# Altium schematic sheet Connectors.SchDoc
size A4
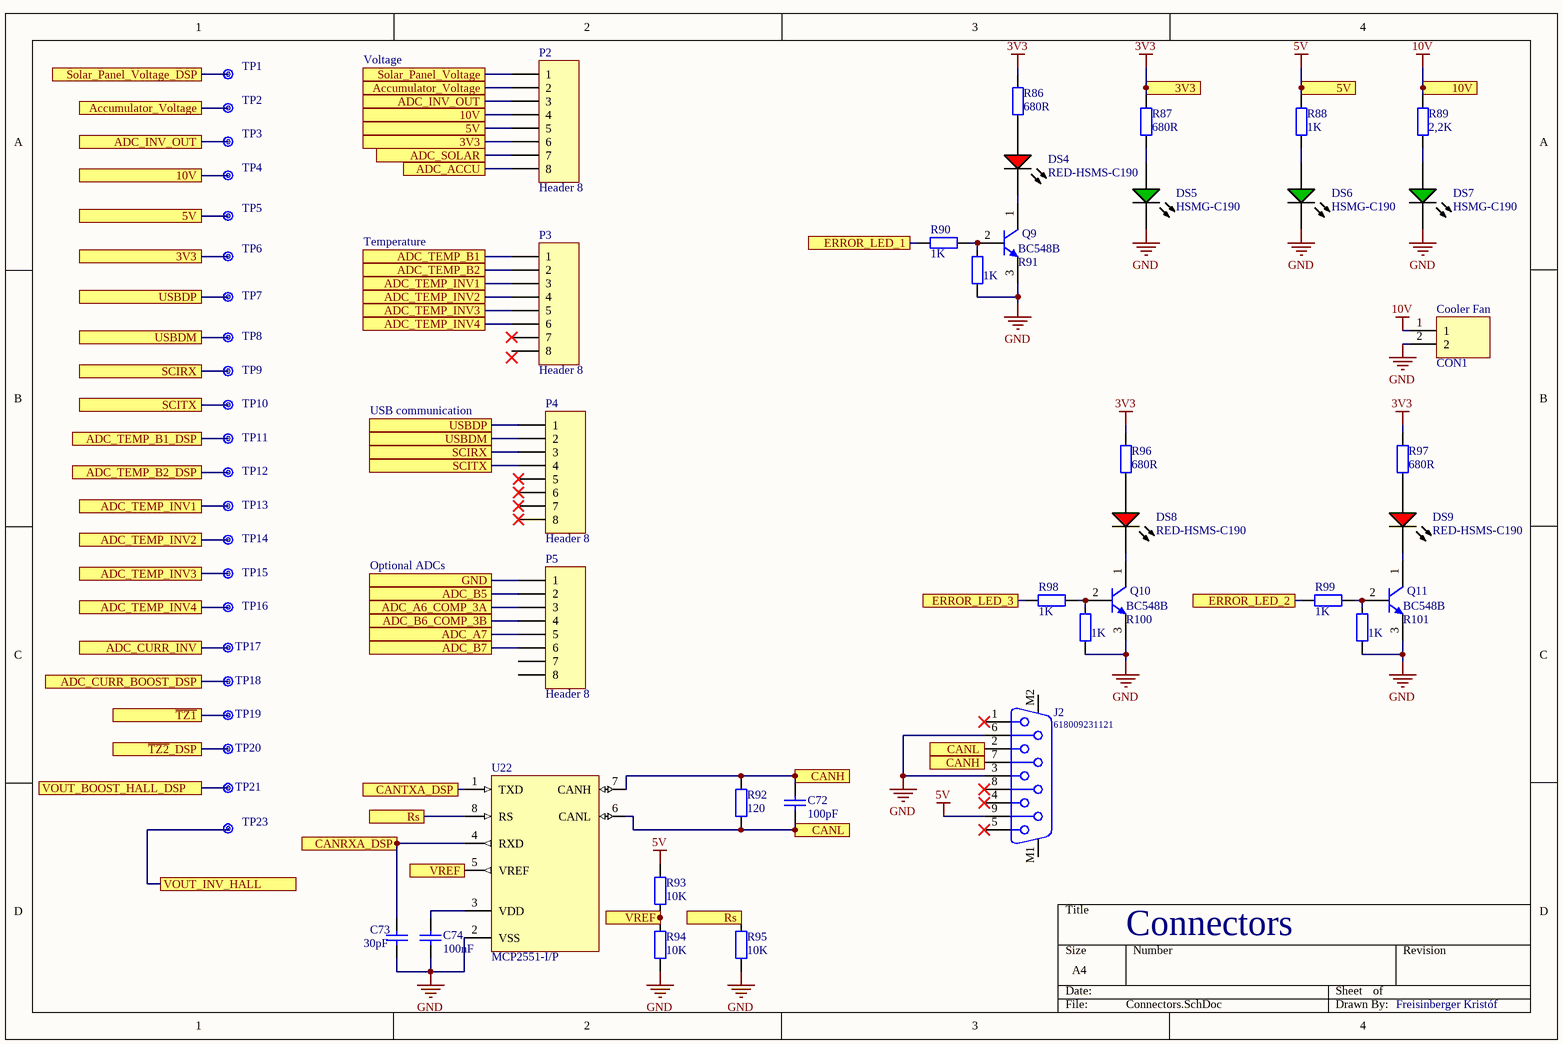
[diagram p0: Connectors.SchDoc]

## Parts
C72  100pF  [FP_0805_CAP_085]
C73  30pF  [FP_0805_CAP_085]
C74  100nF  [FP_0805_CAP_085]
CON1  Connector  [FP_CONN2_TAP_254MM_90]  (value not drawn)
DS4  RED-HSMS-C190  [AVAG-HSMX-C190_V]
DS5  HSMG-C190  [AVAG-HSMX-C190_V]
DS6  HSMG-C190  [AVAG-HSMX-C190_V]
DS7  HSMG-C190  [AVAG-HSMX-C190_V]
DS8  RED-HSMS-C190  [AVAG-HSMX-C190_V]
DS9  RED-HSMS-C190  [AVAG-HSMX-C190_V]
J2  618009231121  [618009231121]
P2  Header 8  [HDR1X8]
P3  Header 8  [HDR1X8]
P4  Header 8  [HDR1X8]
P5  Header 8  [HDR1X8]
Q9  BC548B  [ONSC-TO-92-3-29-11_AM_BL]
Q10  BC548B  [ONSC-TO-92-3-29-11_AM_BL]
Q11  BC548B  [ONSC-TO-92-3-29-11_AM_BL]
R86  680R  [FP_0805_RES]
R87  680R  [FP_0805_RES]
R88  1K  [FP_0805_RES]
R89  2,2K  [FP_0805_RES]
R90  1K  [FP_0805_RES]
R91  1K  [FP_0805_RES]
R92  120  [FP_0805_RES]
R93  10K  [FP_0805_RES]
R94  10K  [FP_0805_RES]
R95  10K  [FP_0805_RES]
R96  680R  [FP_0805_RES]
R97  680R  [FP_0805_RES]
R98  1K  [FP_0805_RES]
R99  1K  [FP_0805_RES]
R100  1K  [FP_0805_RES]
R101  1K  [FP_0805_RES]
TP1  TestPoint  [Test_Point]  (value not drawn)  (no BOM)
TP2  TestPoint  [Test_Point]  (value not drawn)  (no BOM)
TP3  TestPoint  [Test_Point]  (value not drawn)  (no BOM)
TP4  TestPoint  [Test_Point]  (value not drawn)  (no BOM)
TP5  TestPoint  [Test_Point]  (value not drawn)  (no BOM)
TP6  TestPoint  [Test_Point]  (value not drawn)  (no BOM)
TP7  TestPoint  [Test_Point]  (value not drawn)  (no BOM)
TP8  TestPoint  [Test_Point]  (value not drawn)  (no BOM)
TP9  TestPoint  [Test_Point]  (value not drawn)  (no BOM)
TP10  TestPoint  [Test_Point]  (value not drawn)  (no BOM)
TP11  TestPoint  [Test_Point]  (value not drawn)  (no BOM)
TP12  TestPoint  [Test_Point]  (value not drawn)  (no BOM)
TP13  TestPoint  [Test_Point]  (value not drawn)  (no BOM)
TP14  TestPoint  [Test_Point]  (value not drawn)  (no BOM)
TP15  TestPoint  [Test_Point]  (value not drawn)  (no BOM)
TP16  TestPoint  [Test_Point]  (value not drawn)  (no BOM)
TP17  TestPoint  [Test_Point]  (value not drawn)  (no BOM)
TP18  TestPoint  [Test_Point]  (value not drawn)  (no BOM)
TP19  TestPoint  [Test_Point]  (value not drawn)  (no BOM)
TP20  TestPoint  [Test_Point]  (value not drawn)  (no BOM)
TP21  TestPoint  [Test_Point]  (value not drawn)  (no BOM)
TP23  TestPoint  [Test_Point]  (value not drawn)  (no BOM)
U22  MCP2551-I/P  [PDIP300-P8]

## Ports
3V3, 5V, 10V, Accumulator_Voltage, ADC_A6_COMP_3A, ADC_A7, ADC_ACCU, ADC_B5, ADC_B6_COMP_3B, ADC_B7, ADC_CURR_BOOST_DSP, ADC_CURR_INV, ADC_INV_OUT, ADC_SOLAR, ADC_TEMP_B1, ADC_TEMP_B1_DSP, ADC_TEMP_B2, ADC_TEMP_B2_DSP, ADC_TEMP_INV1, ADC_TEMP_INV2, ADC_TEMP_INV3, ADC_TEMP_INV4, CANH, CANL, CANRXA_DSP, CANTXA_DSP, ERROR_LED_1, ERROR_LED_2, ERROR_LED_3, GND, Rs, SCIRX, SCITX, Solar_Panel_Voltage, Solar_Panel_Voltage_DSP, USBDM, USBDP, VOUT_BOOST_HALL_DSP, VOUT_INV_HALL, VREF, ~{TZ1}, ~{TZ2}_DSP

## Nets
3V3: P2.6 R86.2 R87.2 R96.2 R97.2 TP6.1 ; port 3V3
5V: J2.9 P2.5 R88.2 R93.2 TP5.1 ; port 5V
10V: CON1.1 P2.4 R89.2 TP4.1 ; port 10V
GND: C73.1 C74.1 CON1.2 DS5.2(K) DS6.2(K) DS7.2(K) J2.3 J2.6 Q9.3(E) Q10.3(E) Q11.3(E) R91.1 R94.1 R95.1 R100.1 R101.1 U22.2(VSS)
Accumulator_Voltage: P2.2 TP2.1 ; port Accumulator_Voltage
ADC_A6_COMP_3A: P5.3 ; port ADC_A6_COMP_3A
ADC_A7: P5.5 ; port ADC_A7
ADC_ACCU: P2.8 ; port ADC_ACCU
ADC_B5: P5.2 ; port ADC_B5
ADC_B6_COMP_3B: P5.4 ; port ADC_B6_COMP_3B
ADC_B7: P5.6 ; port ADC_B7
ADC_CURR_BOOST_DSP: TP18.1 ; port ADC_CURR_BOOST_DSP
ADC_CURR_INV: TP17.1 ; port ADC_CURR_INV
ADC_INV_OUT: P2.3 TP3.1 ; port ADC_INV_OUT
ADC_SOLAR: P2.7 ; port ADC_SOLAR
ADC_TEMP_B1: P3.1 ; port ADC_TEMP_B1
ADC_TEMP_B1_DSP: TP11.1 ; port ADC_TEMP_B1_DSP
ADC_TEMP_B2: P3.2 ; port ADC_TEMP_B2
ADC_TEMP_B2_DSP: TP12.1 ; port ADC_TEMP_B2_DSP
ADC_TEMP_INV1: P3.3 TP13.1 ; port ADC_TEMP_INV1
ADC_TEMP_INV2: P3.4 TP14.1 ; port ADC_TEMP_INV2
ADC_TEMP_INV3: P3.5 TP15.1 ; port ADC_TEMP_INV3
ADC_TEMP_INV4: P3.6 TP16.1 ; port ADC_TEMP_INV4
CANH: C72.2 J2.7 R92.2 U22.7(CANH) ; port CANH
CANL: C72.1 J2.2 R92.1 U22.6(CANL) ; port CANL
CANRXA_DSP: C73.2 U22.4(RXD) ; port CANRXA_DSP
CANTXA_DSP: U22.1(TXD) ; port CANTXA_DSP
ERROR_LED_1: R90.1 ; port ERROR_LED_1
ERROR_LED_2: R99.1 ; port ERROR_LED_2
ERROR_LED_3: R98.1 ; port ERROR_LED_3
GND: P5.1 ; port GND  [a separate net that carries the same name]
Rs: R95.2 U22.8(RS) ; port Rs
SCIRX: P4.3 TP9.1 ; port SCIRX
SCITX: P4.4 TP10.1 ; port SCITX
Solar_Panel_Voltage: P2.1 ; port Solar_Panel_Voltage
Solar_Panel_Voltage_DSP: TP1.1 ; port Solar_Panel_Voltage_DSP
~{TZ1}: TP19.1 ; port ~{TZ1}
~{TZ2}_DSP: TP20.1 ; port ~{TZ2}_DSP
USBDM: P4.2 TP8.1 ; port USBDM
USBDP: P4.1 TP7.1 ; port USBDP
VOUT_BOOST_HALL_DSP: TP21.1 ; port VOUT_BOOST_HALL_DSP
VOUT_INV_HALL: TP23.1 ; port VOUT_INV_HALL
VREF: R93.1 R94.2 U22.5(VREF) ; port VREF
NetC74_2: C74.2 U22.3(VDD)
NetDS4_1: DS4.1(A) R86.1
NetDS4_2: DS4.2(K) Q9.1(C)
NetDS5_1: DS5.1(A) R87.1
NetDS6_1: DS6.1(A) R88.1
NetDS7_1: DS7.1(A) R89.1
NetDS8_1: DS8.1(A) R96.1
NetDS8_2: DS8.2(K) Q10.1(C)
NetDS9_1: DS9.1(A) R97.1
NetDS9_2: DS9.2(K) Q11.1(C)
NetQ9_2: Q9.2(B) R90.2 R91.2
NetQ10_2: Q10.2(B) R98.2 R100.2
NetQ11_2: Q11.2(B) R99.2 R101.2

Not connected (* = marked no-connect by the designer): J2 1* 4* 5* 8* M1 M2; P3 7* 8; P4 5* 6* 7* 8*; P5 7 8

## Notes on the sheet
- Voltage
- Temperature
- (near CON1) Cooler Fan
- USB communication
- Optional ADCs
- Connectors
- Freisinberger Kristóf

## Library data of the parts
C72-C74 = CAP: Capacitor
  C72: Value: 100pF
  C73: Value: 30pF
  C74: Value: 100nF
CON1 = Connector_2pin: 2pin connector; Reference: 100.240.80; Supplier: hestore
DS4 DS8 DS9 = RED-CMP-2000-06427-1: LED Uni-Color Red, 52 mW, 20 mA, -40 to 85 degC, 2-Pin SMD, RoHS, Tape and Reel; Manufacturer: Avago; Reverse Voltage: 5V; Viewing Angle: 170deg; High Brightness: No; Lens Type: ColorlessDiffused; DELETED: Compliant; Product Height (mm): 0.8mm; Dominant Wave Length: 626nm; Number of  Elements: 1; Chip Material: GaP; Lum Intensity: 10mcd; Product Length (mm): 1.6mm; Forward Voltage: 2.6V; Power Dissipation: 52W; Shape Type: Rectangular; Forward Current: 25mA; Peak Wavelength: 630nm; Test Current (It): 20mA; Main Category: ChipLED; Lens Dimensions: 1x0.8x0.5mm; Pin Count: 2; Package Reference: HSMX-C190; Mounting Technology: SurfaceMount; Mounting: SurfaceMount; Datasheet URL: http://docs.avagotech.com/docs/AV02-0551EN; Package Type: ChipLed; Operating Temperature Classification: Industrial; Datasheet Version: 03/2012; Operating Temp Range: -40Cto85C; Emitting Color: Red; Rad Hardened: No; Manufacturer URL: http://www.avagotech.com/; Luminous Intensity: 10mcd; Package Description: 2-Pin Surface Mount Device, Body 1.6 x 0.8 mm, Height 0.9 mm; Type: Uni-Color; Packaging: TapeandReel; Product Depth (mm): 0.8mm
DS5-DS7 = LED_G_CMP-1744-00002-1: Chip LED, Green, 2.2 V, -40 to 85 degC, 2-Pin SMD, RoHS, Tape and Reel; Frequency: 400 KHz; Max Supply Voltage: 5.5 V; Access Time: 3500 ns; Clock Frequency: 100 KHz; Case\Package: SOIC; Density: 32 kb; Nominal Supply Current: 2 mA; Interface: Serial; Min Supply Voltage: 1.7 V; Packaging: Tape and Reel; PackageReference: HSMX-C190; ComponentLink2URL: http://docs.avagotech.com/docs/AV02-0551EN; RoHSCompliant: true; Pins: 8; REACH SVHC: No SVHC; Max Operating Temperature: 85 degC; Width: 4 mm; Radiation Hardening: No; Package Quantity: 3000; ComponentLink3Description: Package Specification; ComponentLink1Description: Manufacturer URL; Min Operating Temperature: -40 degC; PackageDescription: 2-Pin Surface Mount Device, Body 1.6 x 0.8 mm, Height 0.9 mm; Max Clock Frequency: 100 KHz; Height: 1.5 mm; ComponentLink1URL: http://www.avagotech.com/; DatasheetVersion: Mar-12; ComponentLink2Description: Datasheet; Mount: Surface Mount; Length: 5 mm; ComponentLink3URL: http://www.fairchildsemi.com/dwg/MA/MA03D.pdf
J2 = CMP-1502-00200-1: Female PCB Connector with Hex Screw WR-DSUB, 8.08 mm, Angled, 9 pins; Manufacturer: Wurth Elektronik; Contact Resistance: 30mOhm; Pin Number: 9; Working Voltage: 125VAC; Rated Current: 3A; Gender: Female; Datasheet URL: https://katalog.we-online.de/em/datasheet/6180xx231121.pdf; Packaging: Tray; Package Reference: 618009231121; Operating Temperature: -40to85degC; Manufacturer URL: http://www.we-online.de; Publisher: WurthElektronik; Mounting Technology: THT; Part Number: 618009231121; Orientation: Angled
P2-P5 = Header 8: Header, 8-Pin; Reference: 100.240.95; LatestRevisionDate: 17-Jul-2002; LatestRevisionNote: Re-released for DXP Platform.; Publisher: Altium Limited; Supplier: hestore
Q9-Q11 = CMP-1048-01603-1: Amplifier Transistor, NPN Silicon, 3-Pin TO-92, Pb-Free, Tape and Reel; Manufacturer: On Semiconductor; PartNumber: BC548BRL1G; fT Min (MHz): 150; IC Continuous (A): 0.1; ComponentLink3Description: Package Specification; ComponentLink1Description: Manufacturer URL; Packing: Tape and Reel; ComponentLink1URL: http://www.onsemi.com/; PackageReference: TO-92-3-29-11_AM_BL; Polarity: NPN; ComponentLink3URL: http://www.onsemi.com/pub_link/Collateral/MAC97-D.PDF; DatasheetVersion: Rev. 7; PackageDescription: 3-Pin Transistor Outline, Body 4.825 x 3.685 mm, Pitch 1.27 mm; ComponentLink2Description: Datasheet; Mounting Technology: Through Hole; PackageVersion: Rev. AM; RoHS: TRUE; ComponentLink2URL: http://www.onsemi.com/pub_link/Collateral/BC546-D.PDF
R86-R101 = RES: Resistor
  R86 R87 R96 R97: Value: 680R
  R88 R90 R91 R98-R101: Value: 1K
  R89: Value: 2,2K
  R92: Value: 120
  R93-R95: Value: 10K
TP1-TP21 TP23 = TestPoint: Test Point
U22 = CMP-0186-00101-2: High-Speed CAN Transceiver, 8-Pin PDIP, Industrial Temperature; PackageDescription: 8-Lead Plastic Dual In-Line (P) - 300 mil Body [PDIP]; Code_JEDEC: MS-001; ComponentLink1Description: Manufacturer URL; DatasheetVersion: revF, Jul-2010; PackageReference: PDIP300-P8; ComponentLink3Description: Package Specification; ComponentLink3URL: http://www.microchip.com/stellent/groups/techpub_sg/documents/packagingspec/en012702.pdf; ComponentLink2URL: http://ww1.microchip.com/downloads/en/DeviceDoc/21667F.pdf; ComponentLink1URL: http://www.microchip.com/; RevisionNote: URLs added. DatasheetVersion updated.; PackageVersion: revBB, Aug-2009; ComponentLink2Description: Datasheet